# Altium schematic sheet 02 - WIRELESS_CHARGE.SchDoc
size A4; SheetNumber: 2; SheetTotal: 5; Nome da Sheet: 02 - WIRELESS_CHA; Data: 20/01/2025; Revisão: RV01B
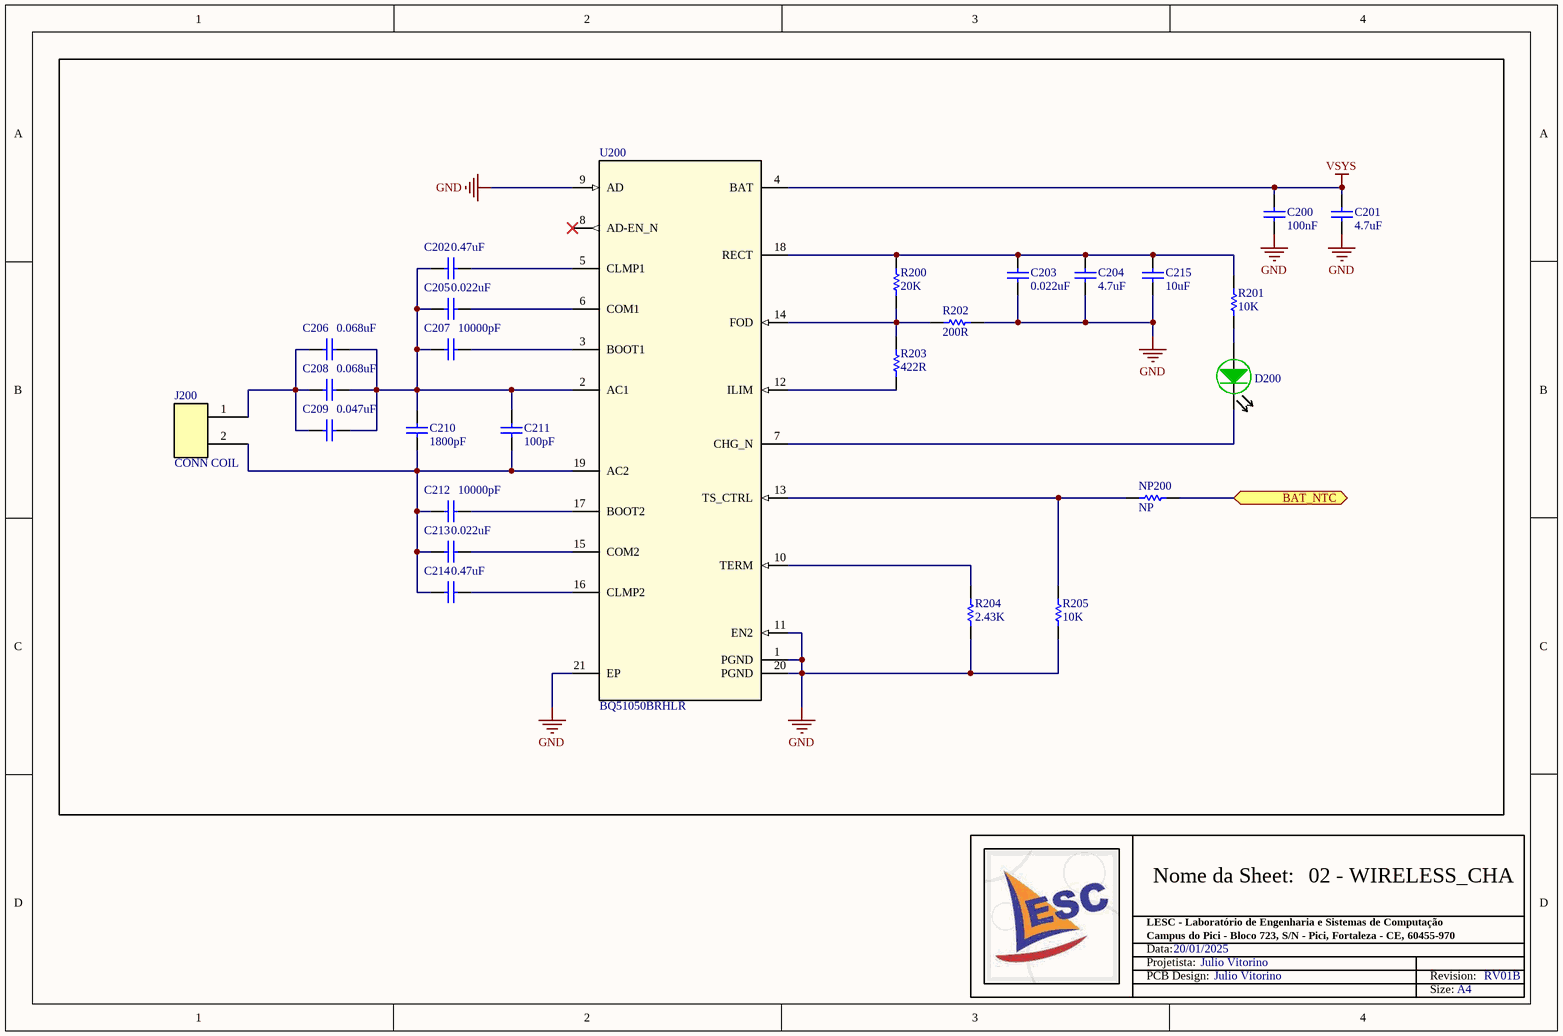
[diagram p0: 02 - WIRELESS_CHARGE.SchDoc]

## Parts
C200  value 100nF  [0402-C-R]  (hidden comment: C0402C104K8RACTU)
C201  value 4.7uF  [0402-C-R]  (hidden comment: GRM155R61A475MEAAD)
C202  value 0.47uF  [0402-C-R]  (hidden comment: GRM155R61H474KE11D)
C203  value 0.022uF  [0402-C-R]  (hidden comment: GCM155R71H223KA55D)
C204  value 4.7uF  [0402-C-R]  (hidden comment: GRM155R61A475MEAAD)
C205  value 0.022uF  [0402-C-R]  (hidden comment: GCM155R71H223KA55D)
C206  value 0.068uF  [0402-C-R]  (hidden comment: GCM155R71H683KE02D)
C207  value 10000pF  [0402-C-R]  (hidden comment: GCM155R71H103KA55D)
C208  value 0.068uF  [0402-C-R]  (hidden comment: GCM155R71H683KE02D)
C209  value 0.047uF  [0402-C-R]  (hidden comment: GCM155R71H473KE02D)
C210  value 1800pF  [0402-C-R]  (hidden comment: GRM1555C1H182JA01D)
C211  value 100pF  [0402-C-R]  (hidden comment: GRM1555C1H101JA01D)
C212  value 10000pF  [0402-C-R]  (hidden comment: GCM155R71H103KA55D)
C213  value 0.022uF  [0402-C-R]  (hidden comment: GCM155R71H223KA55D)
C214  value 0.47uF  [0402-C-R]  (hidden comment: GRM155R61H474KE11D)
C215  value 10uF  [0603-C-R]  (hidden comment: CAP SMD 0603 10uF 10V ±10%)
D200  150060GS75000  [LED0603]  (value not drawn)
J200  CONN COIL  [CONNECTOR COIL]
NP200  NP  [0402-R-NP]
R200  value 20K  [0402-R-R]  (hidden comment: RMCF0402FT20K0)
R201  value 10K  [0402-R-R]  (hidden comment: RMCF0402FT10K0)
R202  value 200R  [0402-R-R]  (hidden comment: RMCF0402JT200R)
R203  value 422R  [0402-R-R]  (hidden comment: RMCF0402FT422R)
R204  value 2.43K  [0402-R-R]  (hidden comment: RMCF0402FT2K43)
R205  value 10K  [0402-R-R]  (hidden comment: RMCF0402FT10K0)
U200  BQ51050BRHLR  [RHL0020A]

## Ports
BAT_NTC (bidir)

## Nets
GND: C200.1 C201.1 C203.1 C204.1 C215.1 R202.1 R204.1 R205.1 U200.1(PGND) U200.9(AD) U200.11(EN2) U200.20(PGND) U200.21(EP)
VSYS: C200.2 C201.2 U200.4(BAT)
BAT_NTC: NP200.2 ; port BAT_NTC
NetC202_1: C202.1 C205.1 C206.2 C207.1 C208.2 C209.2 C210.2 C211.2 U200.2(AC1)
NetC202_2: C202.2 U200.5(CLMP1)
NetC203_2: C203.2 C204.2 C215.2 R200.1 R201.2 U200.18(RECT)
NetC205_2: C205.2 U200.6(COM1)
NetC206_1: C206.1 C208.1 C209.1 J200.1
NetC207_2: C207.2 U200.3(BOOT1)
NetC210_1: C210.1 C211.1 C212.1 C213.1 C214.1 J200.2 U200.19(AC2)
NetC212_2: C212.2 U200.17(BOOT2)
NetC213_2: C213.2 U200.15(COM2)
NetC214_2: C214.2 U200.16(CLMP2)
NetD200_1: D200.1(K) U200.7(CHG_N)
NetD200_2: D200.2(A) R201.1
NetNP200_1: NP200.1 R205.2 U200.13(TS_CTRL)
NetR200_2: R200.2 R202.2 R203.2 U200.14(FOD)
NetR203_1: R203.1 U200.12(ILIM)
NetR204_2: R204.2 U200.10(TERM)

Not connected (* = marked no-connect by the designer): U200 8(AD-EN_N)*

## Notes on the sheet
- LESC - Laboratório de Engenharia e Sistemas de Computação
- Nome da Sheet:
- Data:
- Projetista:
- PCB Design:
- Campus do Pici - Bloco 723, S/N - Pici, Fortaleza - CE, 60455-970
- Julio Vitorino
- Revision:
- Size:
- A4

## Library data of the parts
C200 = CAP SMD 0402 100nF 10V ±20%: CAP SMD 0402 MLCC GERAL 100nF 10V ±20% 0402 X7R PN:C0402C104K8RACTU KEMET; SIZE: 0402; VOLTAGE: 10V; TOLERANCE: 20%; PN: C0402C104K8RACTU
C201 C204 = CAP SMD 0402 4.7uF 10V ±20%: CAP SMD 0402 MLCC GERAL 4.7uF 10V ±20% 0402 X5R PN:GRM155R61A475MEAAD MURATA; SIZE: 0402; VOLTAGE: 10V; TOLERANCE: 20%; PN: GRM155R61A475MEAAD
C202 C214 = CAP SMD 0402 0.47uF 50V ±10%: CAP CER  0.47uF 50V X7R 0402 PN: GRM155R61H474KE11D; TOLERANCE: 10%; POWER: 50V; PN: GRM155R61H474KE11D
C203 C205 C213 = CAP SMD 0402 0.022uF 50V ±10%: CAP CER  0.022uF 50V X7R 0402 PN: GCM155R71H223KA55D; TOLERANCE: 10%; POWER: 50V; PN: GCM155R71H223KA55D
C206 C208 = CAP SMD 0402 0.068uF 50V ±10%: CAP CER 0.068uF 50V X7R 0402 PN: GCM155R71H683KE02D; TOLERANCE: 10%; POWER: 50V; PN: GCM155R71H683KE02D
C207 C212 = CAP SMD 0402 10000pF 50V ±10%: CAP CER 10000PF 50V X7R 0402 PN: GCM155R71H103KA55D; TOLERANCE: 10%; POWER: 50V; PN: GCM155R71H103KA55D
C209 = CAP SMD 0402 0.047uF 50V ±10%: CAP CER  0.047uF 50V X7R 0402 PN: GCM155R71H473KE02D; TOLERANCE: 10%; POWER: 50V; PN: GCM155R71H473KE02D
C210 = CAP SMD 0402 1800pF 50V ±5%: CAP CER 1800PF 50V C0G/NP0 0402 PN: GRM1555C1H182JA01D; TOLERANCE: 5%; POWER: 50V; PN: GRM1555C1H182JA01D
C211 = CAP SMD 0402 100pF 50V ±5%: CAP SMD CER 100pF 50V ±5% 0402 C0G,NP0 TAPE PN: GRM1555C1H101JA01D; TOLERANCE: 1%; POWER: 50V; PN: GRM1555C1H101JA01D
C215 = CAP SMD 0603 10uF 10V ±10%: CAP SMD 0603 MLCC GERAL 10uF 10V ±10% X7R PN: GRM188Z71A106KA73D; SIZE: 0603; PN: GRM188Z71A106KA73D; VOLTAGE: 10V; TOLERANCE: 10%
D200 = LED SMD VD 0603: LED SMD VD ALTO BRILHO 1,6x0,8x0,8mm 430mcd PN:150060GS75000 0603 WURTH; ID: ?; PN: 150060GS75000
J200 = CONN COIL: COIL CONNECTOR
NP200 = RES SMD 0402 NP: PACK: 0402; VALUE: NP
R200 = RES SMD 0402 20K 0.063W ±1%: RES SMD GERAL FILM 20K 0.063W ±1% 0402 7" TAPE PN: RMCF0402FT20K0 STACKPOLE; PACK: 0402; POWER: 0.063W; TOLERANCE: 1%; PN: RMCF0402FT20K0
R201 R205 = RES SMD 0402 10K 0.063W ±1%: RES SMD GERAL FILM 10K 0.063W ±1% 0402 7" TAPE PN: RMCF0402FT10K0 STACKPOLE; PACK: 0402; POWER: 0.063W; TOLERANCE: 1%; PN: RMCF0402FT10K0
R202 = RES SMD 0402 200R 0.063W ±1%: RES SMD GERAL FILM 200R 0.063W ±1% 0402 7" TAPE PN: RMCF0402JT200R STACKPOLE; PACK: 0402; POWER: 0.063W; TOLERANCE: 1%; PN: RMCF0402JT200R
R203 = RES SMD 0402 422R 0.063W ±1%: RES SMD GERAL FILM 422R 0.063W ±1% 0402 7" TAPE PN: RMCF0402FT422R STACKPOLE; PACK: 0402; POWER: 0.063W; TOLERANCE: 1%; PN: RMCF0402FT422R
R204 = RES SMD 0402 2.43K 0.063W ±1%: RES SMD GERAL FILM 2.43K 0.063W ±1% 0402 7" TAPE PN: RMCF0402FT2K43 STACKPOLE; PACK: 0402; POWER: 0.063W; TOLERANCE: 1%; PN: RMCF0402FT2K43
U200 = IC WIRELESS PWR RCVR 20QFN: Wireless Power Receiver PMIC 20-VQFN (3.5x4.5) PN: BQ51050BRHLR; Mfr_Name: Texas Instruments; TYPE: TYPE; RefDes: RefDes; PN: BQ51050BRHLR